# Altium schematic sheet adc.SchDoc
size 209 x 297 mm
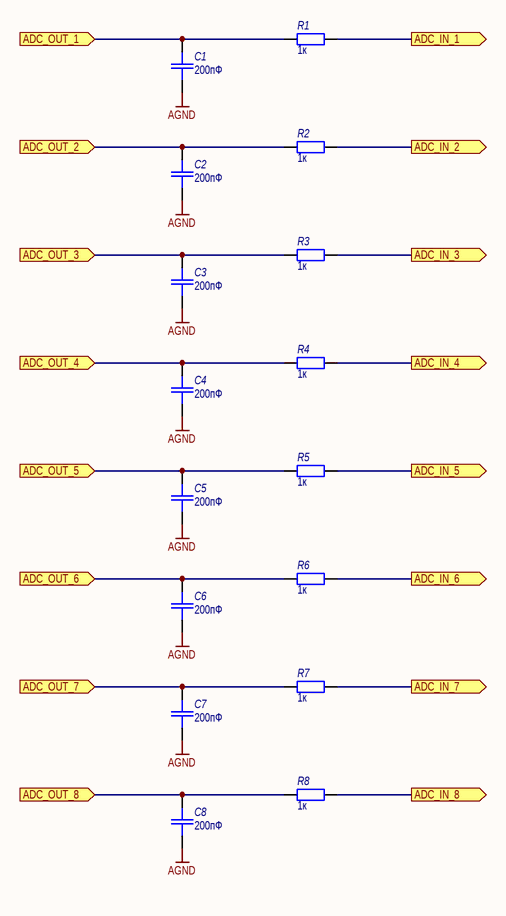
[diagram p0: adc.SchDoc]

## Parts
C1  200пФ  [SMD_0805]
C2  200пФ  [SMD_0805]
C3  200пФ  [SMD_0805]
C4  200пФ  [SMD_0805]
C5  200пФ  [SMD_0805]
C6  200пФ  [SMD_0805]
C7  200пФ  [SMD_0805]
C8  200пФ  [SMD_0805]
R1  1к  [SMD_0805]
R2  1к  [SMD_0805]
R3  1к  [SMD_0805]
R4  1к  [SMD_0805]
R5  1к  [SMD_0805]
R6  1к  [SMD_0805]
R7  1к  [SMD_0805]
R8  1к  [SMD_0805]

## Ports
ADC_IN_1 (out), ADC_IN_2 (out), ADC_IN_3 (out), ADC_IN_4 (out), ADC_IN_5 (out), ADC_IN_6 (out), ADC_IN_7 (out), ADC_IN_8 (out), ADC_OUT_1 (in), ADC_OUT_2 (in), ADC_OUT_3 (in), ADC_OUT_4 (in), ADC_OUT_5 (in), ADC_OUT_6 (in), ADC_OUT_7 (in), ADC_OUT_8 (in)

## Nets
AGND: C1.1 C2.1 C3.1 C4.1 C5.1 C6.1 C7.1 C8.1
ADC_IN_1: R1.2 ; port ADC_IN_1
ADC_IN_2: R2.2 ; port ADC_IN_2
ADC_IN_3: R3.2 ; port ADC_IN_3
ADC_IN_4: R4.2 ; port ADC_IN_4
ADC_IN_5: R5.2 ; port ADC_IN_5
ADC_IN_6: R6.2 ; port ADC_IN_6
ADC_IN_7: R7.2 ; port ADC_IN_7
ADC_IN_8: R8.2 ; port ADC_IN_8
ADC_OUT_1: C1.2 R1.1 ; port ADC_OUT_1
ADC_OUT_2: C2.2 R2.1 ; port ADC_OUT_2
ADC_OUT_3: C3.2 R3.1 ; port ADC_OUT_3
ADC_OUT_4: C4.2 R4.1 ; port ADC_OUT_4
ADC_OUT_5: C5.2 R5.1 ; port ADC_OUT_5
ADC_OUT_6: C6.2 R6.1 ; port ADC_OUT_6
ADC_OUT_7: C7.2 R7.1 ; port ADC_OUT_7
ADC_OUT_8: C8.2 R8.1 ; port ADC_OUT_8

## Notes on the sheet
- Подп. и дата
- Инв. № дубл.
- Взам. инв. №
- Инв. № подл.
- Изм.
- Лист
- № докум.
- Подп.
- Дата
- Форма 2а ГОСТ 2.104-2006
- Копировал
- Формат А4

## Library data of the parts
C1-C8 = Capacitor: Назначение: SMD-конденсатор; Наименование: Конденсатор; Потребление, Вт: 0; Value: 0,1мкФ
R1-R8 = Resistor: Наименование: Резистор; Назначение: SMD-резистор; Потребление, Вт: 0,001; Value: 1к